# Altium schematic sheet Power_.SchDoc
size A4
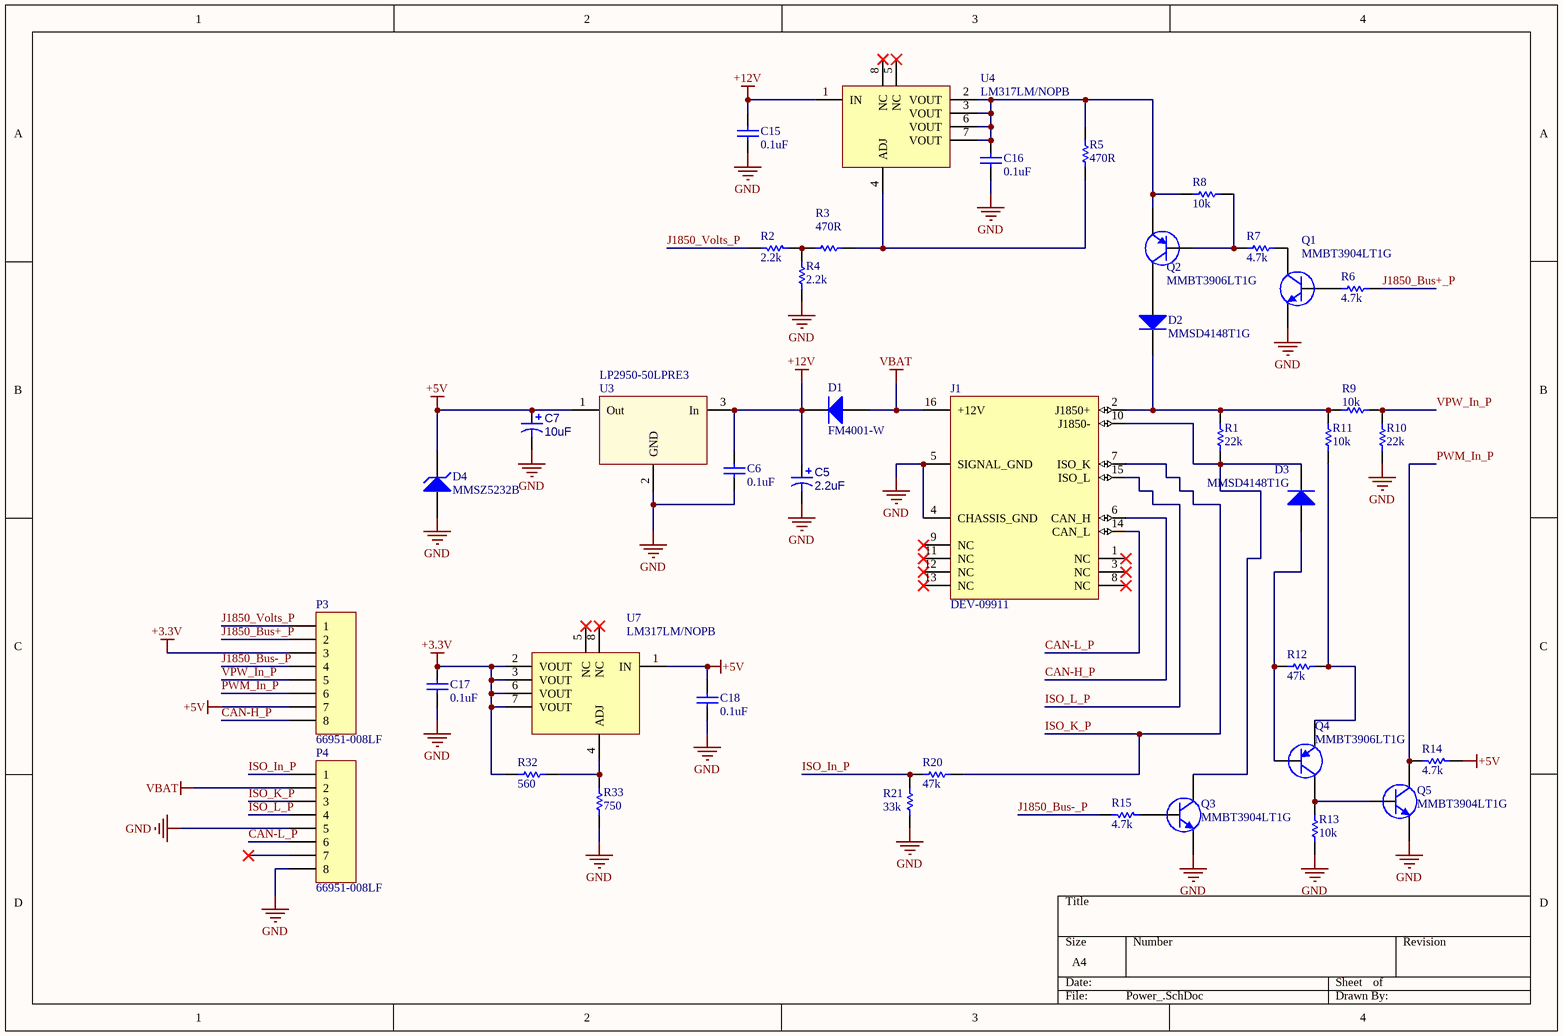
[diagram p0: Power_.SchDoc]

## Parts
C5  2.2uF  [Panasonic_Ñ]
C6  0.1uF  [1608[0603]]
C7  10uF  [Panasonic_B]
C15  0.1uF  [1608[0603]]
C16  0.1uF  [1608[0603]]
C17  0.1uF  [1608[0603]]
C18  0.1uF  [1608[0603]]
D1  FM4001-W  [SMA,2.8mm]
D2  MMSD4148T1G  [SOD123]
D3  MMSD4148T1G  [SOD123]
D4  MMSZ5232B  [SOD123]
J1  DEV-09911  [DEV-09911 - II]
P3  66951-008LF  [HDR1X8]
P4  66951-008LF  [HDR1X8]
Q1  MMBT3904LT1G  [SOT23]
Q2  MMBT3906LT1G  [SOT23]
Q3  MMBT3904LT1G  [SOT23]
Q4  MMBT3906LT1G  [SOT23]
Q5  MMBT3904LT1G  [SOT23]
R1  22k  [ERA-0805]
R2  2.2k  [ERA-0805]
R3  470R  [ERA-0805]
R4  2.2k  [ERA-0805]
R5  470R  [ERA-0805]
R6  4.7k  [ERA-0805]
R7  4.7k  [ERA-0805]
R8  10k  [ERA-0805]
R9  10k  [ERA-0805]
R10  22k  [ERA-0805]
R11  10k  [ERA-0805]
R12  47k  [ERA-0805]
R13  10k  [ERA-0805]
R14  4.7k  [ERA-0805]
R15  4.7k  [ERA-0805]
R20  47k  [ERA-0805]
R21  33k  [ERA-0805]
R32  560  [ERA-0805]
R33  750  [ERA-0805]
U3  LP2950-50LPRE3  [TO-92]
U4  LM317LM/NOPB  [SOIC8N]
U7  LM317LM/NOPB  [SOIC8N]

## Nets
+3.3V: C17.2 P3.3 R32.1 U7.2(VOUT) U7.3(VOUT) U7.6(VOUT) U7.7(VOUT)
+5V: C7.1 C18.2 D4.1(K) P3.7 R14.1 U3.1(Out) U7.1(IN)
+12V: C5.1 C6.2 C15.2 D1.2(K) U3.3(In) U4.1(IN)
GND: C5.2 C6.1 C7.2 C15.1 C16.1 C17.1 C18.1 D4.2(A) J1.4(CHASSIS_GND) J1.5(SIGNAL_GND) P4.5 P4.8 Q1.2(E) Q3.2(E) Q5.2(E) R4.1 R10.1 R13.2 R21.1 R33.1 U3.2(GND)
VBAT: D1.1(A) J1.16(+12V) P4.2
CAN-H_P: J1.6(CAN_H) P3.8
CAN-L_P: J1.14(CAN_L) P4.6
ISO_In_P: P4.1 R20.1 R21.2
ISO_K_P: J1.7(ISO_K) P4.3 R20.2
ISO_L_P: J1.15(ISO_L) P4.4
J1850_Bus+_P: P3.2 R6.2
J1850_Bus-_P: P3.4 R15.2
J1850_Volts_P: P3.1 R2.2
PWM_In_P: P3.6 Q5.3(C) R14.2
VPW_In_P: P3.5 R9.1 R10.2
NetC16_2: C16.2 Q2.2(E) R5.2 R8.2 U4.2(VOUT) U4.3(VOUT) U4.6(VOUT) U4.7(VOUT)
NetD2_1: D2.1(A) Q2.3(C)
NetD2_2: D2.2(C) J1.2(J1850+) R1.2 R9.2 R11.1
NetD3_1: D3.1(A) Q4.1(B) R12.1
NetD3_2: D3.2(C) J1.10(J1850-) Q3.3(C) R1.1
NetQ1_1: Q1.1(B) R6.1
NetQ1_3: Q1.3(C) R7.2
NetQ2_1: Q2.1(B) R7.1 R8.1
NetQ3_1: Q3.1(B) R15.1
NetQ4_2: Q4.2(E) R11.2 R12.2
NetQ4_3: Q4.3(C) Q5.1(B) R13.1
NetR2_1: R2.1 R3.2 R4.2
NetR3_1: R3.1 R5.1 U4.4(ADJ)
NetR32_2: R32.2 R33.2 U7.4(ADJ)

Not connected (* = marked no-connect by the designer): J1 1(NC)* 3(NC)* 8(NC)* 9(NC)* 11(NC)* 12(NC)* 13(NC)*; P4 7*; U4 5(NC)* 8(NC)*; U7 5(NC)* 8(NC)*

## Library data of the parts
C5 = EEE-1HA2R2NR: CAP ELECT 2.2UF SV 50V SMD; Manufacturer: Panasonic; Tolerance: +/-20%; Value: 2.2uF; PartNumber: EEE-1HA2R2NR; Voltage: 50V
C6 C17 C18 = C0603C104K5RACTU: Surface-Mount Ceramic Multilayer Capacitor, 0.1uF, 10% Tolerance, 0603 Size, 50V; PackageReference: 1608(0603); PackageDescription: Chip Capacitor; Site: http://www.kemet.com/kemet/web/homepage/kechome.nsf/vapubfiles/KEM_C1002_X7R_SMD.pdf/$file/KEM_C1002_X7R_SMD.pdf; Value: 0.1uF
C7 = EEE-1AA100NR: CAP ELECT 10UF SV 10V SMD; Manufacturer: Panasonic; Tolerance: +/-20%; Value: 10uF; PartNumber: EEE-1AA100NR; Voltage: 10V
C15 C16 = CGA3E2X7R1E104K080AA: Surface-Mount Ceramic Multilayer Capacitor, 0.1uF, X7R, 10% Tolerance, 0603 Size, 25V; PackageReference: 0402; PackageDescription: Chip Capacitor; Site: http://product.tdk.com/capacitor/mlcc/en/documents/mlccspec_automotive_general_midvoltage_en.pdf; Value: 0.1uF; Publisher: Altium Limited
D1 = FM4001-W: 1 Amp 50V  Rectifier; PackageReference: DO214AC(SMA); ComponentLink1Description: Datasheet; ComponentLink1URL: http://lib.chipdip.ru/758/DOC000758182.pdf
D2 D3 = MMSD4148T1G: High Conductance Fast Diode; Manufacturer: OnSemi; Approved: M. Jablonski; TargetLibrary: Diodes; Current: 200 mA; Published: 6/4/2009; Publisher: Vanteon; LeadFree: Yes; RoHS: Yes; PartNumber: MMSD4148T1G; ComponentLink1Description: Datasheet; ComponentLink1URL: http://www.onsemi.com/pub_link/Collateral/MMSD4148T1-D.PDF; Status: Active; Supplier 1: Digi-Key; Supplier Part Number 1: MMSD4148T1GOSCT-ND
D4 = MMSZ5232B: Zener Diodes 5.6 Volt 0.5W 5%; PackageReference: SOD-123; PackageDescription: Diode, Thru-Hole; 2 Leads; 0.7 in Pin Spacing
J1 = OBDII_DEV-09911: OBD-II Connector; Manufacturer: SparkFun Electronics; PartNumber: DEV-09911
P3 P4 = 66951-008LF: Connector, 8-Pin, 2.54 pitch, 1 row; LatestRevisionDate: 17-Jul-2002; LatestRevisionNote: Re-released for DXP Platform.; Publisher: Altium Limited
Q1 Q3 Q5 = MMBT3904L: NPN 3904 General Purpose Amplifier; Manufacturer: ON Semiconductor; Value: 0.2A, 40V; Approved: Yes by Implemenation; TargetLibrary: Transistors; Published: 8/13/2009; Publisher: Vanteon; LeadFree: Yes; RoHS: Yes; PartNumber: MMBT3904LT1G; ComponentLink1Description: Datasheet; ComponentLink1URL: http://www.onsemi.com/pub_link/Collateral/MMBT3904LT1-D.PDF; Status: Active; Supplier 1: Digi-Key; Supplier Part Number 1: MMBT3904LT1GOSCT-ND
Q2 Q4 = MMBT3906L: PNP 3906 General Purpose Amplifier; Manufacturer: ON Semiconductor; Value: 0.2A, -40V; Approved: Yes by Implemenation; TargetLibrary: Transistors; Published: 8/13/2009; Publisher: Vanteon; LeadFree: Yes; RoHS: Yes; PartNumber: MMBT3906LT1G; ComponentLink1Description: Datasheet; ComponentLink1URL: http://www.onsemi.com/pub_link/Collateral/MMBT3906LT1-D.PDF; Status: Active; Supplier 1: Digi-Key; Supplier Part Number 1: MMBT3906LT1GOSCT-ND
R1 R10 = ERA6AEB223V: Rectangular Thick Film Chip Resistor, 22 kOhm, 0.1% Tolerance, 0805 Size, 0.125 W; Note: If flow soldering, adjust pad width of PCB Footprint to 0.7 - 0.8 times the width of the resistor.; LatestRevisionNote: Silkscreen size reduced.; PackageReference: ERA-0805; Code_IPC: 2012 [0805]; ComponentLink1Description: Manufacturer Link; ComponentLink1URL: http://industrial.panasonic.com/www-data/pdf/AOA0000/AOA0000CE26.pdf; Value: 22k
R2 R4 = ERA6AEB222V: Rectangular Thick Film Chip Resistor, 2.2 kOhm, 0.1% Tolerance, 0805 Size, 0.125 W; Note: If flow soldering, adjust pad width of PCB Footprint to 0.7 - 0.8 times the width of the resistor.; LatestRevisionNote: Silkscreen size reduced.; PackageReference: ERA-0805; Code_IPC: 2012 [0805]; ComponentLink1Description: Manufacturer Link; ComponentLink1URL: http://industrial.panasonic.com/www-data/pdf/AOA0000/AOA0000CE26.pdf; Value: 2.2k
R3 R5 = ERA6AEB471V: Rectangular Thick Film Chip Resistor, 470 Ohm, 0.1% Tolerance, 0805 Size, 0.125 W; Note: If flow soldering, adjust pad width of PCB Footprint to 0.7 - 0.8 times the width of the resistor.; LatestRevisionNote: Silkscreen size reduced.; PackageReference: ERA-0805; Code_IPC: 2012 [0805]; ComponentLink1Description: Manufacturer Link; ComponentLink1URL: http://industrial.panasonic.com/www-data/pdf/AOA0000/AOA0000CE26.pdf; Value: 470R
R6 R7 R14 R15 = ERA6AEB472V: Rectangular Thick Film Chip Resistor, 4.7 kOhm, 0.1% Tolerance, 0805 Size, 0.125 W; Note: If flow soldering, adjust pad width of PCB Footprint to 0.7 - 0.8 times the width of the resistor.; LatestRevisionNote: Silkscreen size reduced.; PackageReference: ERA-0805; Code_IPC: 2012 [0805]; ComponentLink1Description: Manufacturer Link; ComponentLink1URL: http://industrial.panasonic.com/www-data/pdf/AOA0000/AOA0000CE26.pdf; Value: 4.7k
R8 R9 R11 R13 = ERA6AEB103V: Rectangular Thick Film Chip Resistor, 10 kOhm, 0.1% Tolerance, 0805 Size, 0.125 W; Note: If flow soldering, adjust pad width of PCB Footprint to 0.7 - 0.8 times the width of the resistor.; LatestRevisionNote: Silkscreen size reduced.; PackageReference: ERA-0805; Code_IPC: 2012 [0805]; ComponentLink1Description: Manufacturer Link; ComponentLink1URL: http://industrial.panasonic.com/www-data/pdf/AOA0000/AOA0000CE26.pdf; Value: 10k
R12 R20 = ERA6AEB473V: Rectangular Thick Film Chip Resistor, 47 kOhm, 0.1% Tolerance, 0805 Size, 0.125 W; Note: If flow soldering, adjust pad width of PCB Footprint to 0.7 - 0.8 times the width of the resistor.; LatestRevisionNote: Silkscreen size reduced.; PackageReference: ERA-0805; Code_IPC: 2012 [0805]; ComponentLink1Description: Manufacturer Link; ComponentLink1URL: http://industrial.panasonic.com/www-data/pdf/AOA0000/AOA0000CE26.pdf; Value: 47k
R21 = ERA6AEB333V: Rectangular Thick Film Chip Resistor, 33 kOhm, 0.1% Tolerance, 0805 Size, 0.125 W; Note: If flow soldering, adjust pad width of PCB Footprint to 0.7 - 0.8 times the width of the resistor.; LatestRevisionNote: Silkscreen size reduced.; PackageReference: ERA-0805; Code_IPC: 2012 [0805]; ComponentLink1Description: Manufacturer Link; ComponentLink1URL: http://industrial.panasonic.com/www-data/pdf/AOA0000/AOA0000CE26.pdf; Value: 33k
R32 = ERJ6ENF5600V: Rectangular Thick Film Chip Resistor, 560 Ohm, 1% Tolerance, 0805 Size, 0.125 W; Note: If flow soldering, adjust pad width of PCB Footprint to 0.7 - 0.8 times the width of the resistor.; LatestRevisionNote: Silkscreen size reduced.; PackageReference: ERA-0805; Code_IPC: 2012 [0805]; ComponentLink1Description: Manufacturer Link; ComponentLink1URL: http://industrial.panasonic.com/www-data/pdf/AOA0000/AOA0000CE26.pdf; Value: 560
R33 = ERJ6ENF7500V: Rectangular Thick Film Chip Resistor, 750 Ohm, 1% Tolerance, 0805 Size, 0.125 W; Note: If flow soldering, adjust pad width of PCB Footprint to 0.7 - 0.8 times the width of the resistor.; LatestRevisionNote: Silkscreen size reduced.; PackageReference: ERA-0805; Code_IPC: 2012 [0805]; ComponentLink1Description: Manufacturer Link; ComponentLink1URL: http://industrial.panasonic.com/www-data/pdf/AOA0000/AOA0000CE26.pdf; Value: 750
U3 = LP2950-50LPRE3: Adjustable Micropower Voltage Regulator With Shutdown; 5V; 100 mA; PackageReference: TO-92; ComponentLink1Description: Datasheet; ComponentLink1URL: http://www.ti.com/lit/ds/slvs582h/slvs582h.pdf
U4 U7 = LM317LM: 3-terminal adjustable regulator in SO8; Manufacturer: National Semiconductor; Approved: Yes by Implementation; TargetLibrary: Power IC; PartNumber: LM317LM/NOPB; Publisher: Vanteon; Published: 8/3/2009; ComponentLink1Description: Datasheet; ComponentLink1URL: http://www.national.com/ds/LM/LM317L.pdf; LeadFree: Yes; RoHS: Yes; Status: Active; Supplier 1: Digi-Key; Supplier Part Number 1: LM317LM-ND